# EasyEDA schematic SCH_cansat2025_2025-10-21.json
TITLE: Sheet_1; REV: 1.0; Date: 2025-10-17; Sheet: 1/1; Drawn By: kamil232323232; Company: Your Company
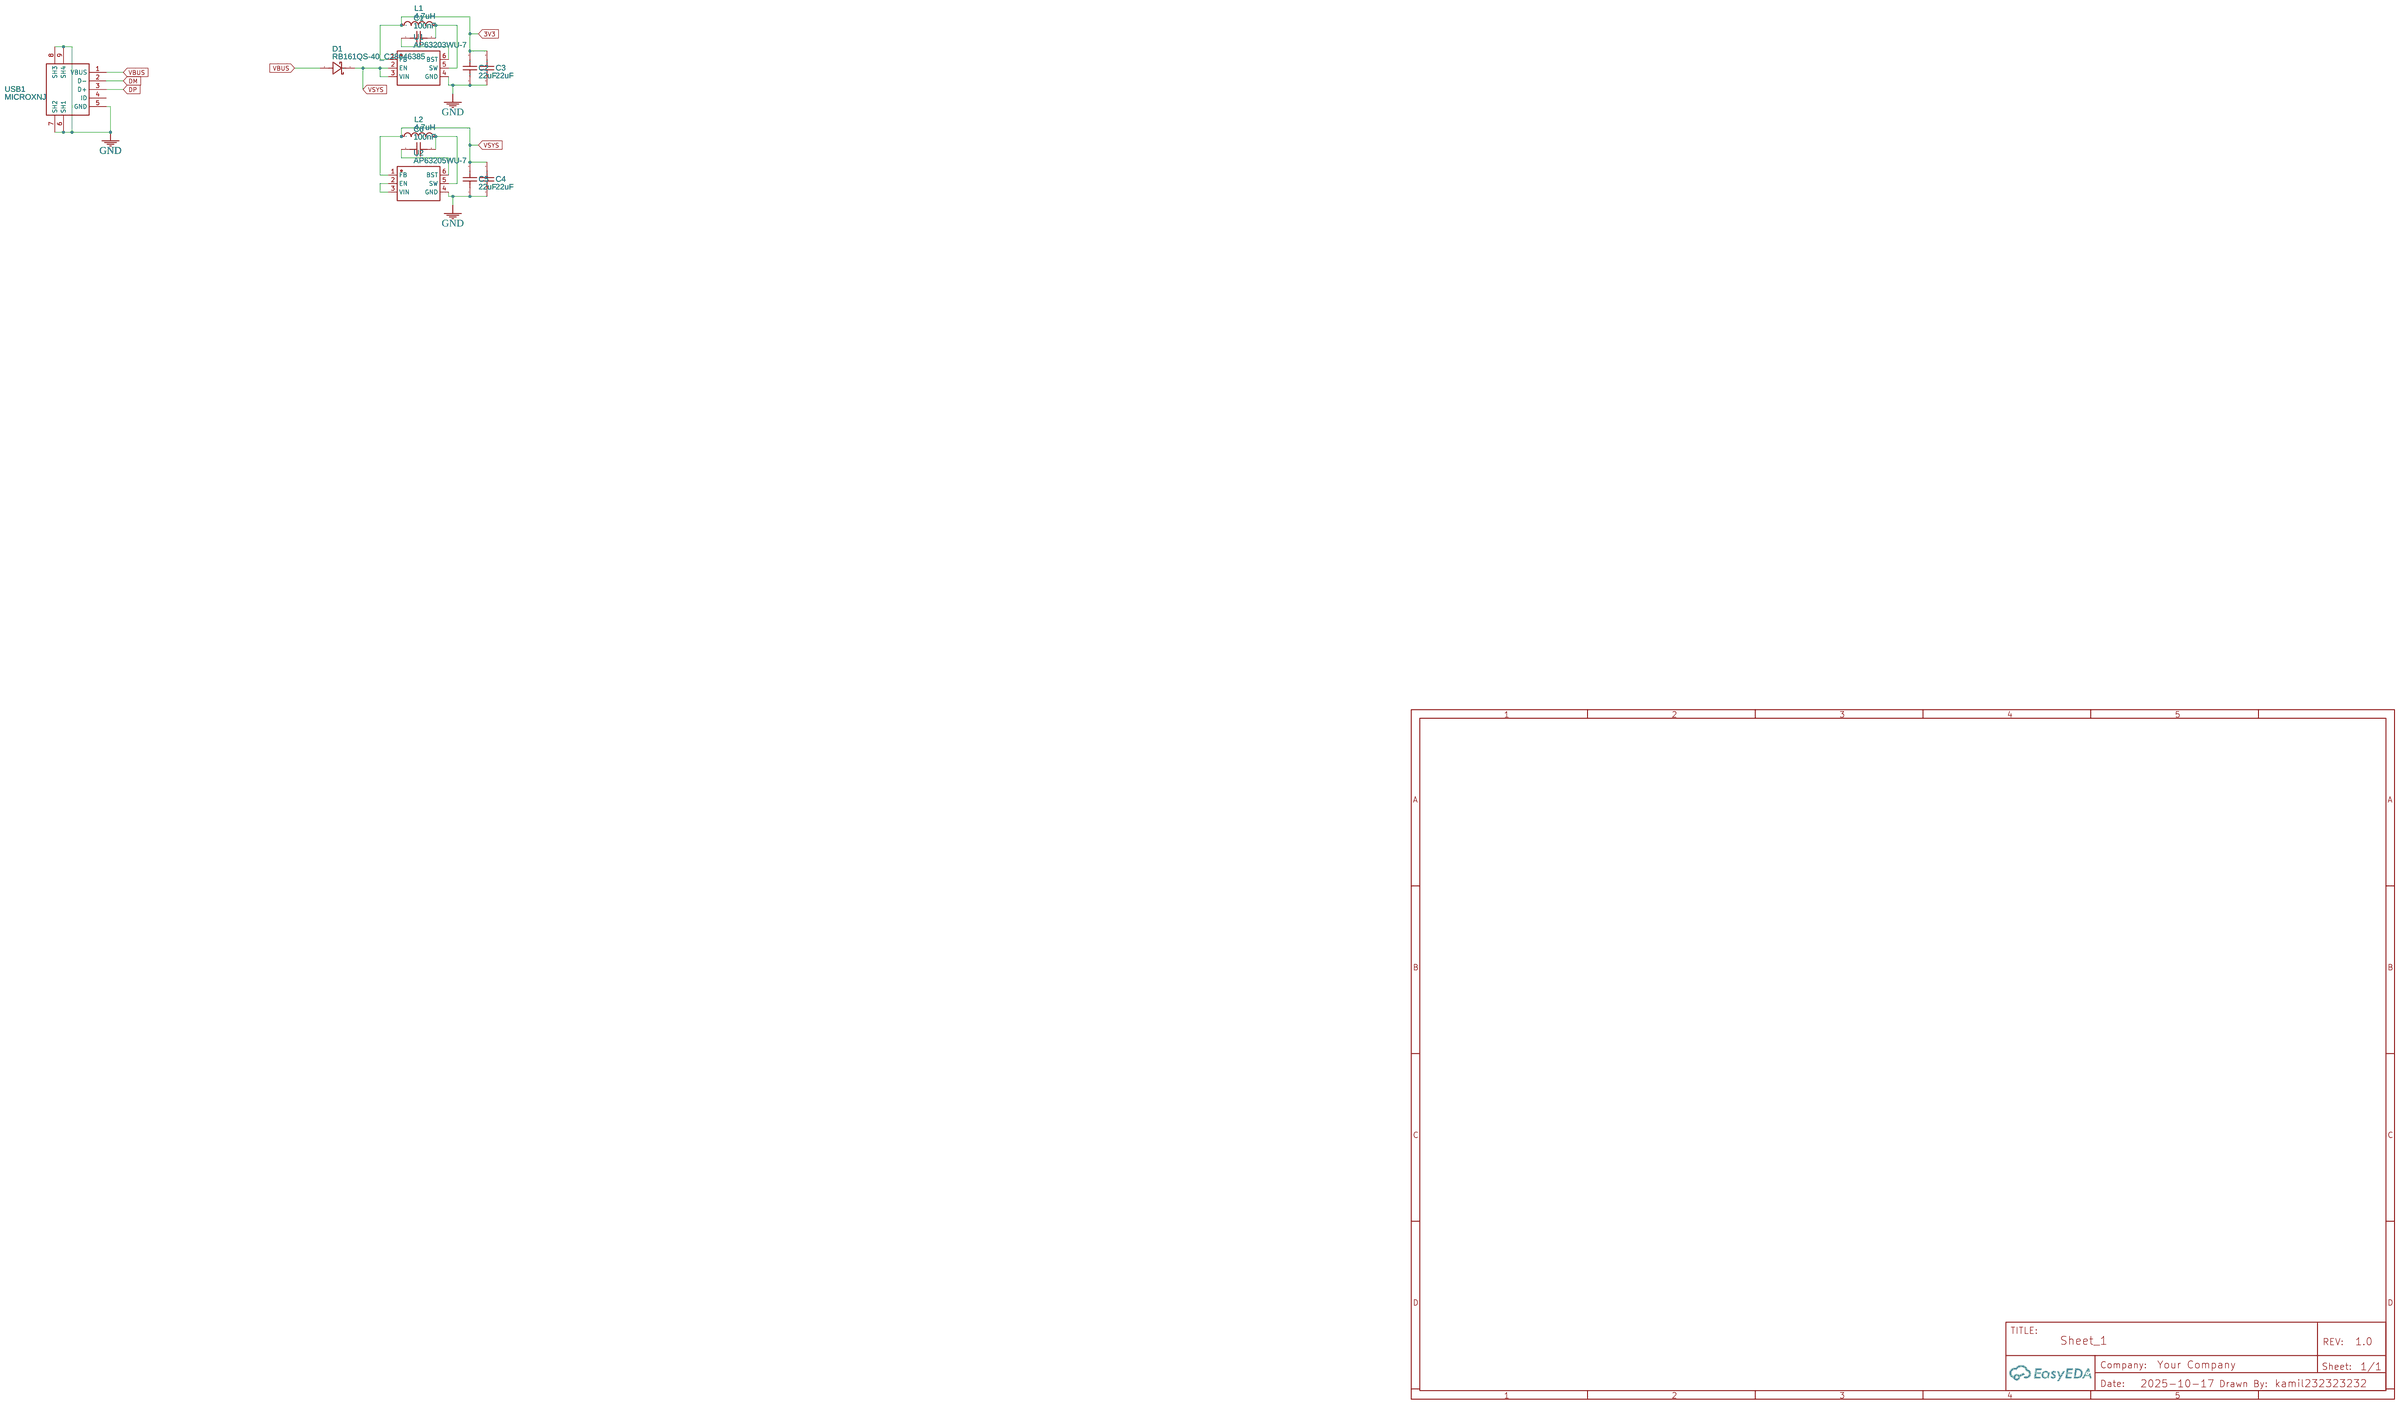
[diagram p0: schematic sheet]

## Parts
C1  100nF  [C0402]
C2  22uF  [C0402]
C3  22uF  [C0402]
C4  22uF  [C0402]
C5  22uF  [C0402]
C6  100nF  [C0402]
D1  RB161QS-40_C28646385  [SOD-882_L1.0-W0.6-RD]
L1  4.7uH  [L0805]
L2  4.7uH  [L0805]
U1  AP63203WU-7  [TSOT-26_L2.9-W1.6-P0.95-LS2.8-BL]
U2  AP63205WU-7  [TSOT-23-6_L2.9-W1.6-P0.95-LS2.8-BL]
USB1  MICROXNJ  [MICRO-USB-SMD_MICROXNJ]

## Library data of the parts
C1 C6 = FCC0402B104K160AT: Supplier: LCSC; Supplier Part: C5137468; Manufacturer: FOJAN(富捷); JLCPCB Part Class: Extended Part; Contributor: lcsc
C2-C5 = GRM155R60J226ME11D: Contributor: LCSC; Supplier: LCSC; Supplier Part: C415703; Manufacturer: muRata(村田); JLCPCB Part Class: Extended Part
D1 = RB161QS-40_C28646385: Supplier: LCSC; Supplier Part: C28646385; Manufacturer: TECH PUBLIC(台舟); Manufacturer Part: RB161QS-40; JLCPCB Part Class: Extended Part; Contributor: lcsc
L1 L2 = CMI201209U4R7KT: Supplier: LCSC; Manufacturer: FH(风华); Supplier Part: C99365; JLCPCB Part Class: Extended Part
U1 = AP63203WU-7: Contributor: LCSC; Supplier: LCSC; Supplier Part: C780769; Manufacturer: DIODES(美台); JLCPCB Part Class: Extended Part
U2 = AP63205WU-7: Contributor: LCSC; Supplier: LCSC; Supplier Part: C2071056; Manufacturer: DIODES(美台); JLCPCB Part Class: Extended Part
USB1 = MICROXNJ: Contributor: LCSC; Supplier: LCSC; Supplier Part: C404969; Manufacturer: SHOU HAN(首韩); Manufacturer Part: MicroXNJ; JLCPCB Part Class: Extended Part

## Nets
3V3: C2.2 C3.2 L1.1 U1.1(FB)
GND: C2.1 C3.1 C4.1 C5.1 U1.4(GND) U2.4(GND) USB1.5(GND) USB1.6(SH1) USB1.7(SH2) USB1.8(SH3) USB1.9(SH4)
VBUS: D1.2(A) USB1.1(VBUS)
DM: USB1.2(D-)
DP: USB1.3(D+)
VSYS: C4.2 C5.2 D1.1(C) L2.1 U1.2(EN) U1.3(VIN) U2.1(FB)
Net-(C1-1): C1.1 U1.6(BST)
Net-(C1-2): C1.2 L1.2 U1.5(SW)
Net-(C6-1): C6.1 U2.6(BST)
Net-(C6-2): C6.2 L2.2 U2.5(SW)
Net-(U2-2): U2.2(EN) U2.3(VIN)

Not connected (* = marked no-connect by the designer): USB1 4(ID)
